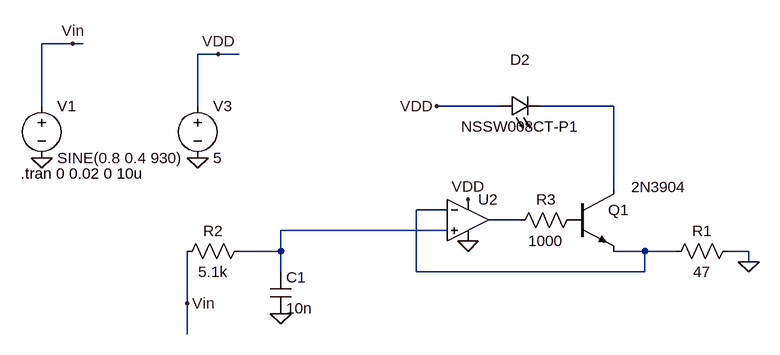
[diagram p0: schematic analogLEDCircuit.asc]
analogLEDCircuit.asc, the LTspice schematic file:
Version 4
SHEET 1 880 680
WIRE -448 -368 -496 -368
WIRE -432 -368 -448 -368
WIRE -224 -352 -256 -352
WIRE -192 -352 -224 -352
WIRE -496 -272 -496 -368
WIRE -256 -272 -256 -352
WIRE 208 -272 112 -272
WIRE 384 -272 272 -272
WIRE 384 -144 384 -272
WIRE 128 -112 80 -112
WIRE 240 -96 192 -96
WIRE 128 -80 -128 -80
WIRE -128 -48 -128 -80
WIRE -128 -48 -192 -48
WIRE 432 -48 384 -48
WIRE 480 -48 432 -48
WIRE 592 -48 560 -48
WIRE 592 -32 592 -48
WIRE -128 -16 -128 -48
WIRE 80 -16 80 -112
WIRE 432 -16 432 -48
WIRE 432 -16 80 -16
WIRE -272 32 -272 -48
WIRE -272 80 -272 32
FLAG -496 -192 0
FLAG -256 -192 0
FLAG -224 -352 VDD
FLAG 160 -128 VDD
FLAG 160 -64 0
FLAG -128 48 0
FLAG 592 -32 0
FLAG 112 -272 VDD
FLAG -272 32 Vin
FLAG -448 -368 Vin
SYMBOL voltage -496 -288 R0
WINDOW 123 0 0 Left 0
WINDOW 39 0 0 Left 0
SYMATTR InstName V1
SYMATTR Value SINE(0.8 0.4 930)
SYMBOL voltage -256 -288 R0
SYMATTR InstName V3
SYMATTR Value 5
SYMBOL OpAmps\\UniversalOpAmp 160 -96 R0
SYMATTR InstName U2
SYMBOL LED 208 -256 R270
WINDOW 0 72 32 VTop 2
WINDOW 3 0 32 VBottom 2
SYMATTR InstName D2
SYMATTR Value NSSW008CT-P1
SYMATTR Description Diode
SYMATTR Type diode
SYMBOL res 576 -64 R90
WINDOW 0 0 56 VBottom 2
WINDOW 3 32 56 VTop 2
SYMATTR InstName R1
SYMATTR Value 47
SYMBOL res -176 -64 R90
WINDOW 0 0 56 VBottom 2
WINDOW 3 32 56 VTop 2
SYMATTR InstName R2
SYMATTR Value 5.1k
SYMBOL cap -144 -16 R0
SYMATTR InstName C1
SYMATTR Value 10n
SYMBOL npn 320 -144 R0
WINDOW 3 91 -3 Left 2
SYMATTR Value 2N3904
SYMATTR InstName Q1
SYMBOL res 336 -112 R90
WINDOW 0 0 56 VBottom 2
WINDOW 3 32 56 VTop 2
SYMATTR InstName R3
SYMATTR Value 1000
TEXT -528 -168 Left 2 !.tran 0 0.02 0 10u

The netlist it stands for:
* analogLEDCircuit.asc
V1 Vin 0 SINE(0.8 0.4 930)
V3 VDD 0 5
XU2 N004 N002 VDD 0 N003 level1 Avol=1Meg GBW=10Meg Vos=0 En=0 Enk=0 In=0 Ink=0 Rin=500Meg  ; pins In+ In- V+ V- OUT
D2 VDD N001 NSSW008CT-P1
R1 0 N002 47
R2 N004 Vin 5.1k
C1 N004 0 10n
Q1 N001 P001 N002 0 2N3904
R3 P001 N003 1000
.model D D
.lib standard.dio
.model NPN NPN
.model PNP PNP
.lib standard.bjt
.tran 0 0.02 0 10u
.lib UniversalOpAmp1.lib
.backanno
.end